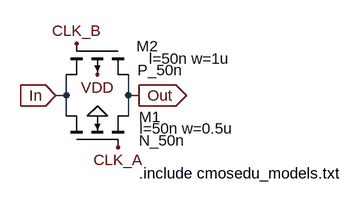
[diagram p0: schematic Clock.asc]
Clock.asc, the LTspice schematic file:
Version 4
SHEET 1 880 680
WIRE 240 208 240 176
WIRE 240 208 224 208
WIRE 336 208 336 176
WIRE 352 208 336 208
WIRE 240 240 240 208
WIRE 336 240 336 208
FLAG 224 208 In
IOPIN 224 208 In
FLAG 352 208 Out
IOPIN 352 208 Out
FLAG 288 240 0
FLAG 288 176 VDD
FLAG 320 288 CLK_A
FLAG 256 128 CLK_B
SYMBOL nmos4 240 288 R270
WINDOW 0 47 112 VRight 2
WINDOW 3 11 112 VRight 2
WINDOW 123 29 113 VRight 2
SYMATTR InstName M1
SYMATTR Value N_50n
SYMATTR Value2 l=50n w=0.5u
SYMBOL pmos4 336 128 R90
WINDOW 0 4 -46 VRight 2
WINDOW 3 41 -84 VRight 2
WINDOW 123 23 -157 VRight 2
SYMATTR InstName M2
SYMATTR Value P_50n
SYMATTR Value2 l=50n w=1u
TEXT 352 328 Left 2 !.include cmosedu_models.txt

The netlist it stands for:
* Clock.asc
M1 In CLK_A Out 0 N_50n l=50n w=0.5u
M2 Out CLK_B In VDD P_50n l=50n w=1u
.model NMOS NMOS
.model PMOS PMOS
.lib standard.mos
.include cmosedu_models.txt
.backanno
.end